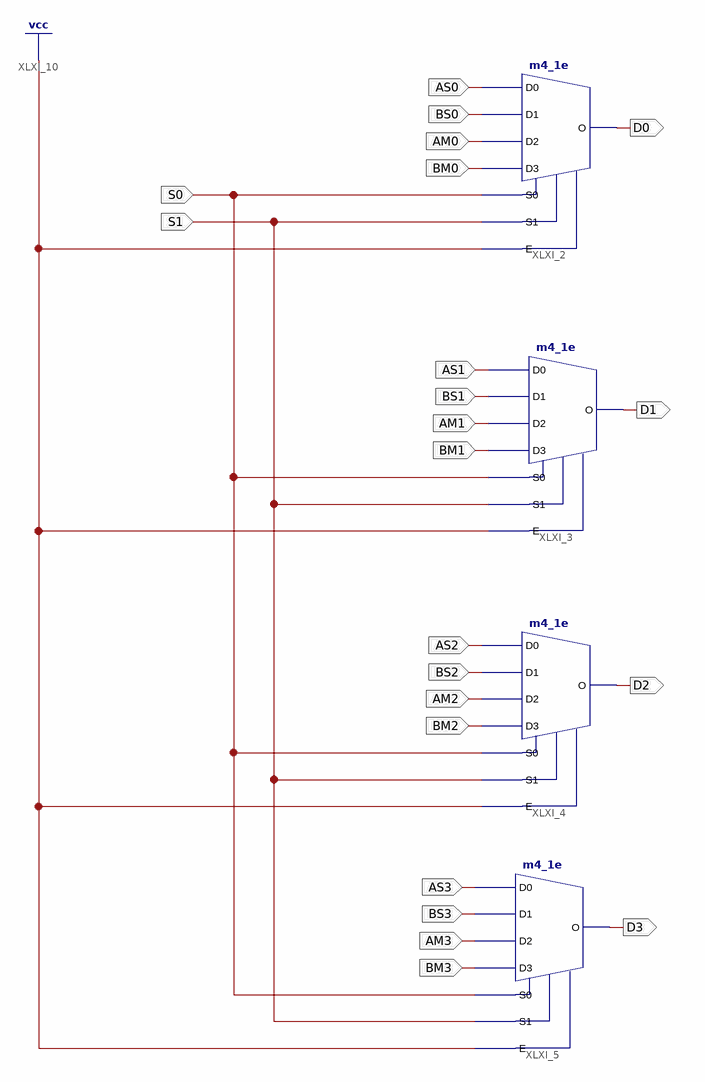
[diagram p0: schematic sheet 1]
// Xilinx ISE schematic SELBCD.sch (spartan6) as structural Verilog: 4 symbols, 22 ports
module SELBCD (
  input  AS0,
  input  BS0,
  input  AM0,
  input  BM0,
  input  S0,
  input  S1,
  input  AS1,
  input  BS1,
  input  AM1,
  input  BM1,
  input  AS2,
  input  BS2,
  input  AM2,
  input  BM2,
  input  AS3,
  input  BS3,
  input  AM3,
  input  BM3,
  output D3,
  output D2,
  output D1,
  output D0
);

  m4_1e XLXI_2 (.D0(AS0), .D1(BS0), .D2(AM0), .D3(BM0), .E(1'b1), .S0(S0), .S1(S1), .O(D0));
  m4_1e XLXI_3 (.D0(AS1), .D1(BS1), .D2(AM1), .D3(BM1), .E(1'b1), .S0(S0), .S1(S1), .O(D1));
  m4_1e XLXI_4 (.D0(AS2), .D1(BS2), .D2(AM2), .D3(BM2), .E(1'b1), .S0(S0), .S1(S1), .O(D2));
  m4_1e XLXI_5 (.D0(AS3), .D1(BS3), .D2(AM3), .D3(BM3), .E(1'b1), .S0(S0), .S1(S1), .O(D3));
endmodule
